# Altium schematic sheet AFWS_V3.1_Slave.SchDoc
size A4
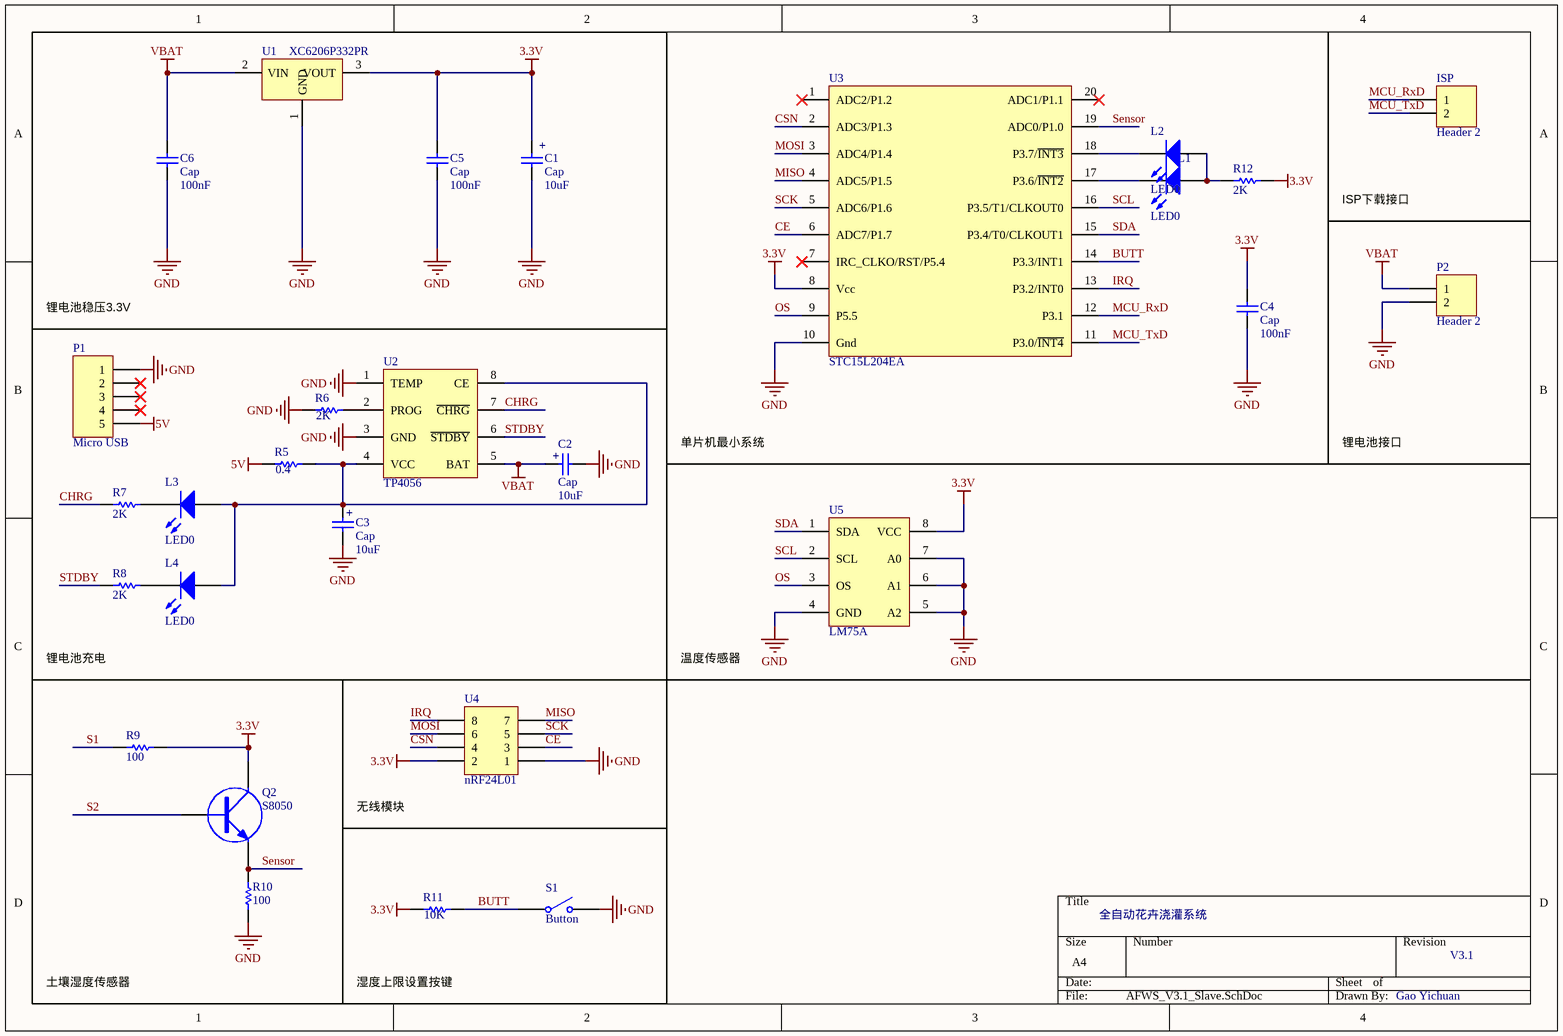
[diagram p0: AFWS_V3.1_Slave.SchDoc]

## Parts
C1  Cap  value 10uF  [RESC6332]
C2  Cap  value 10uF  [RESC6332]
C3  Cap  value 10uF  [RESC6332]
C4  Cap  value 100nF  [0805]
C5  Cap  value 100nF  [0805]
C6  Cap  value 100nF  [0805]
ISP  Header 2  [HDR1X2]
L1  LED0  [0805]
L2  LED0  [0805]
L3  LED0  [0805]
L4  LED0  [0805]
P1  Micro USB  [Micro_USB]
P2  Header 2  [HDR1X2]
Q2  S8050  [SOT-23]
R5  value 0.4  [1206]  (hidden comment: Res1)
R6  value 2K  [0805]  (hidden comment: Res1)
R7  value 2K  [0805]  (hidden comment: Res1)
R8  value 2K  [0805]  (hidden comment: Res1)
R9  value 100  [0805]  (hidden comment: Res1)
R10  value 100  [0805]  (hidden comment: Res1)
R11  value 10K  [0805]  (hidden comment: Res1)
R12  value 2K  [0805]  (hidden comment: Res1)
S1  Button  [Button2]
U1  XC6206P332PR  [SOT-89]
U2  TP4056  [SO-08]
U3  STC15L204EA  [SOL-20]
U4  nRF24L01  [HDR2X4]
U5  LM75A  [SO-08]

## Nets
3.3V: C1.2 C4.2 C5.2 Q2.2(C) R9.1 R11.1 R12.1 U1.3(VOUT) U3.8(Vcc) U4.2 U5.8(VCC)
5V: P1.5 R5.1
GND: C1.1 C2.2 C3.1 C4.1 C5.1 C6.1 P1.1 P2.2 R6.1 R10.2 S1.2(NO) U1.1(GND) U2.1(TEMP) U2.3(GND) U3.10(Gnd) U4.1 U5.4(GND) U5.5(A2) U5.6(A1) U5.7(A0)
VBAT: C2.1 C6.2 P2.1 U1.2(VIN) U2.5(BAT)
BUTT: R11.2 S1.1(COMMON) U3.14(P3.3/INT1)
CE: U3.6(ADC7/P1.7) U4.3
CHRG: R7.2 U2.7(~{CHRG})
CSN: U3.2(ADC3/P1.3) U4.4
IRQ: U3.13(P3.2/INT0) U4.8
MCU_RxD: ISP.1 U3.12(P3.1)
MCU_TxD: ISP.2 U3.11(P3.0/~{INT4})
MISO: U3.4(ADC5/P1.5) U4.7
MOSI: U3.3(ADC4/P1.4) U4.6
OS: U3.9(P5.5) U5.3(OS)
S1: R9.2
S2: Q2.1(B)
SCK: U3.5(ADC6/P1.6) U4.5
SCL: U3.16(P3.5/T1/CLKOUT0) U5.2(SCL)
SDA: U3.15(P3.4/T0/CLKOUT1) U5.1(SDA)
Sensor: Q2.3(E) R10.1 U3.19(ADC0/P1.0)
STDBY: R8.2 U2.6(~{STDBY})
NetC3_2: C3.2 L3.1(A) L4.1(A) R5.2 U2.4(VCC) U2.8(CE)
NetL1_1: L1.1(A) L2.1(A) R12.2
NetL1_2: L1.2(K) U3.17(P3.6/~{INT2})
NetL2_2: L2.2(K) U3.18(P3.7/~{INT3})
NetL3_2: L3.2(K) R7.1
NetL4_2: L4.2(K) R8.1
NetR6_2: R6.2 U2.2(PROG)

Not connected (* = marked no-connect by the designer): P1 2* 3* 4*; U3 1(ADC2/P1.2)* 7(IRC_CLKO/RST/P5.4)* 20(ADC1/P1.1)*

## Notes on the sheet
- (near C1) +
- ISP下载接口
- 锂电池稳压3.3V
- 单片机最小系统
- 锂电池接口
- (near C3) +
- (near C2) +
- 锂电池充电
- 温度传感器
- 无线模块
- 全自动花卉浇灌系统
- 土壤湿度传感器
- 湿度上限设置按键
- V3.1
- Gao Yichuan

## Library data of the parts
C1-C6 = Cap: Capacitor; Published: 8-Jun-2000; LatestRevisionDate: 17-Jul-2002; LatestRevisionNote: Re-released for DXP Platform.; PackageReference: RAD-0.3; Publisher: Altium Limited; PackageDescription: Radial Cap, Thru-Hole; 2 Leads; 0.3 in Pin Spacing
ISP P2 = Header 2: Header, 2-Pin; LatestRevisionDate: 17-Jul-2002; LatestRevisionNote: Re-released for DXP Platform.; Publisher: Altium Limited
L1-L4 = LED0: Typical INFRARED GaAs LED; Published: 8-Jun-2000; LatestRevisionDate: 08-Jul-2005; LatestRevisionNote: Mech Layer 1 removed.; PackageReference: LED-0; Publisher: Altium Limited; PackageDescription: LED; 2 Leads
P1 = Header 5: Header, 5-Pin; LatestRevisionDate: 17-Jul-2002; LatestRevisionNote: Re-released for DXP Platform.; Publisher: Altium Limited
Q2 = NPN: NPN Transistor
R5-R12 = Res1: Resistor; Published: 8-Jun-2000; LatestRevisionDate: 17-Jul-2002; LatestRevisionNote: Re-released for DXP Platform.; PackageReference: AXIAL-0.3; Publisher: Altium Limited; PackageDescription: Axial Device, Thru-Hole; 2 Leads; 0.3 in Pin Spacing
S1 = SW-SPST: Single-Pole, Single-Throw Switch; Published: 24-Mar-1999; LatestRevisionDate: 17-Jul-2002; LatestRevisionNote: Re-released for DXP Platform.; PackageReference: SPST-2; Publisher: Altium Limited; PackageDescription: Switch; 2 Leads
U1 = XC6206
U4 = Header 4X2: Header, 4-Pin, Dual row; LatestRevisionDate: 17-Jul-2002; LatestRevisionNote: Re-released for DXP Platform.; Publisher: Altium Limited